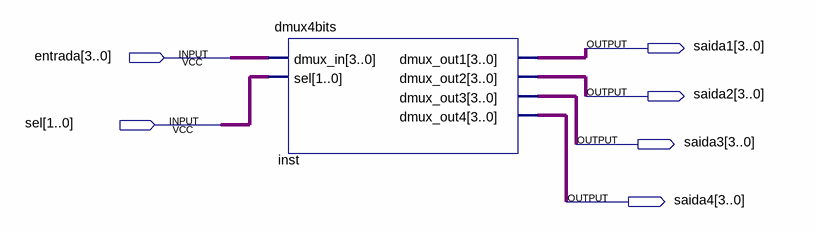
[diagram p0: schematic sheet]
// Quartus schematic testando_dmux.bdf as structural Verilog: 1 symbols, 6 pins
module testando_dmux (
  input  [3:0] entrada,
  input  [1:0] sel,
  output [3:0] saida1,
  output [3:0] saida2,
  output [3:0] saida3,
  output [3:0] saida4
);

  dmux4bits inst (
    .dmux_in(entrada), .sel(sel), .dmux_out1(saida1), .dmux_out2(saida2), .dmux_out3(saida3),
    .dmux_out4(saida4));
endmodule
